# Altium project ESP32-S3.PrjPcb
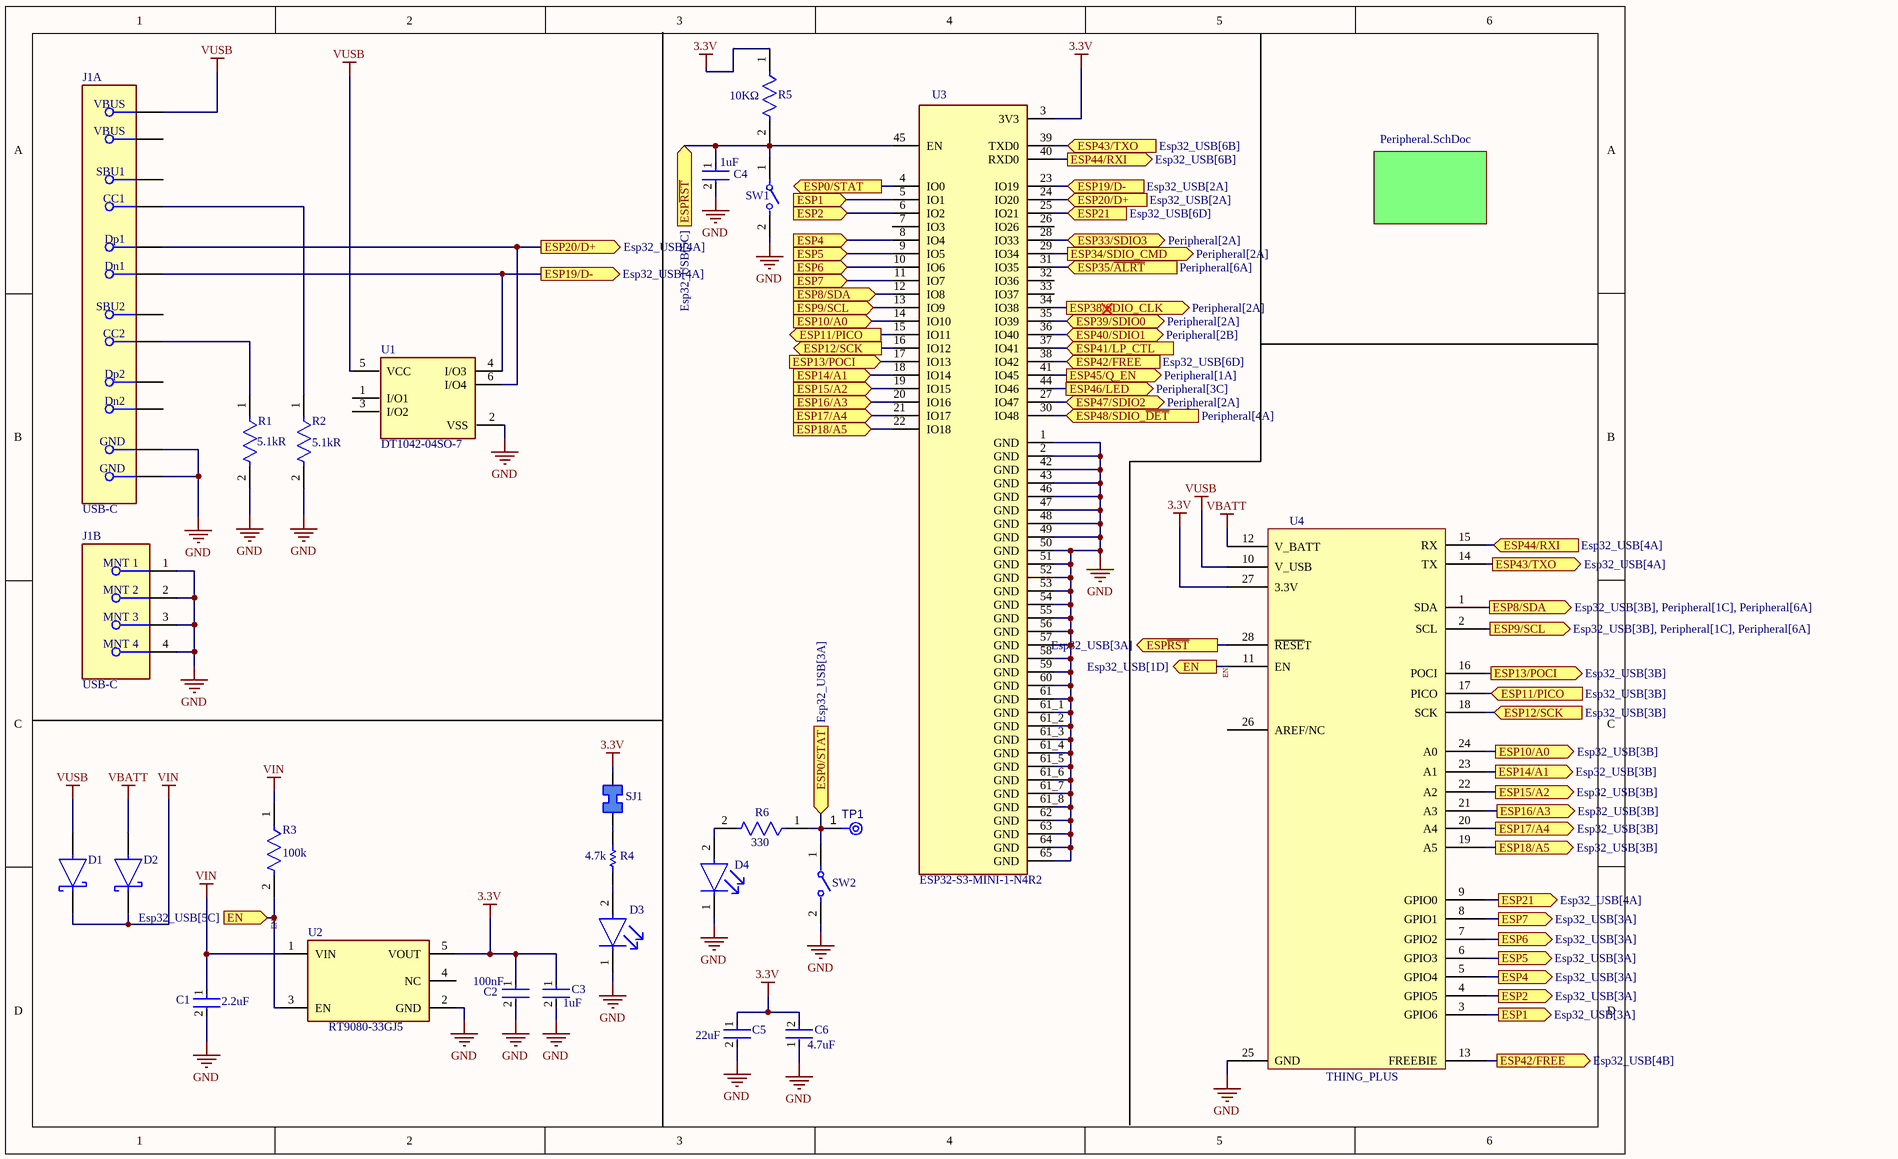
[diagram p0: Esp32_USB.SchDoc]
2 sheets, 56 parts. Net scope: flat (ports and power ports of the same name join across sheets).
Board file: PCB.PcbDoc
Sheets:
  Esp32_USB.SchDoc
    Designator = Peripheral.SchDoc

## Sheet Esp32_USB.SchDoc
size 304 x 215 mm; SheetNumber: 1; SheetTotal: 2

### Parts
C1  Capacitance: 2.2uF  [FP-GRM155-0_1-IPC_C]  (hidden comment: GRM155C81A225KE44D)
C2  Capacitance: 100nF  [FP-GRM033-0_03-IPC_B]  (hidden comment: GRM033C70J104KE14D)
C3  Capacitance: 1uF  [FP-GRM155-0_05-IPC_C]  (hidden comment: GRM155R61C105KA12D)
C4  Capacitance: 1uF  [FP-0402-L_1_0_0_05-W_0_5-IPC_B]  (hidden comment: EMK105BJ105KVHF)
C5  Capacitance: 22uF  [FP-0603-L_1_6_0_2-W_0_8_0-IPC_B]  (hidden comment: JMK107BC6226MA-T)
C6  Capacitance: 4.7uF  [FP-0402-L_1_0_0_15-W_0_5-IPC_C]  (hidden comment: JMK105BC6475MV-F)
D1  BAT60AE6327HTSA1  [FP-PG-SOD323-2-IPC_C]  (value not drawn)
D2  BAT60AE6327HTSA1  [FP-PG-SOD323-2-IPC_C]  (value not drawn)
D3  LTST-C191KRKT  [FP-LTST-C191KRKT-MFG]  (value not drawn)
D4  LTST-C194TGKT  [FP-LTST-C194TGKT-MFG]  (value not drawn)
J1  USB-C  [FP-2171790001-MFG]  (parts A,B of 2)
R1  Resistance: 5.1kR  [FP-AC0402-IPC_C]  (hidden comment: AC0402JR-075K1L)
R2  Resistance: 5.1kR  [FP-AC0402-IPC_C]  (hidden comment: AC0402JR-075K1L)
R3  Resistance: 100k  [FP-CRCW0402-C-e3-MFG]  (hidden comment: CRCW0402100KFKEDC)
R4  Resistance: 4.7k  [RESC1005X40X25LL05T10]  (hidden comment: CRCW04024K70FKEDHP)
R5  value 10KΩ  [FP-RT0201-MFG]  (hidden comment: RT0201FRE0710KL)
R6  Resistance: 330  [FP-AC0603-MFG]  (hidden comment: AC0603FR-07330RL)
SJ1  Solder Jumper  [Solder Jumper-Footprint-1]  (value not drawn)
SW1  FSM2JART  [FP-FSM2JART-MFG]  (value not drawn)
SW2  FSM2JART  [FP-FSM2JART-MFG]  (value not drawn)
TP1  TPAD6R  [TP06R]  (value not drawn)  (no BOM)
U1  DT1042-04SO-7  [FP-SOT26_SC74R-MFG]
U2  RT9080-33GJ5  [FP-RT9080-33GJ5-IPC_C]
U3  ESP32-S3-MINI-1-N4R2  [XCVR_ESP32-S3-MINI-1-N4R2]
U4  THING_PLUS  (no BOM)

### Sub-sheets
Designator = Peripheral.SchDoc: no entries

### Ports
EN (in, see Esp32_USB[5C]), EN (out, see Esp32_USB[1D]), ESP0/STAT (in, see Esp32_USB[3A]), ESP0/STAT (out, see Esp32_USB[4C]), ESP1 (in, see Esp32_USB[6D]), ESP1 (out, see Esp32_USB[3A]), ESP2 (in, see Esp32_USB[6D]), ESP2 (out, see Esp32_USB[3A]), ESP4 (in, see Esp32_USB[6D]), ESP4 (out, see Esp32_USB[3A]), ESP5 (in, see Esp32_USB[6D]), ESP5 (out, see Esp32_USB[3A]), ESP6 (in, see Esp32_USB[6D]), ESP6 (out, see Esp32_USB[3A]), ESP7 (in, see Esp32_USB[6D]), ESP7 (out, see Esp32_USB[3A]), ESP8/SDA (in, see Esp32_USB[6C], Peripheral[1C], Peripheral[6A]), ESP8/SDA (out, see Esp32_USB[3B], Peripheral[1C], Peripheral[6A]), ESP9/SCL (in, see Esp32_USB[6C], Peripheral[1C], Peripheral[6A]), ESP9/SCL (out, see Esp32_USB[3B], Peripheral[1C], Peripheral[6A]), ESP10/A0 (in, see Esp32_USB[6C]), ESP10/A0 (out, see Esp32_USB[3B]), ESP11/PICO (in, see Esp32_USB[3B]), ESP11/PICO (out, see Esp32_USB[6C]), ESP12/SCK (in, see Esp32_USB[3B]), ESP12/SCK (out, see Esp32_USB[6C]), ESP13/POCI (in, see Esp32_USB[6C]), ESP13/POCI (out, see Esp32_USB[3B]), ESP14/A1 (in, see Esp32_USB[6C]), ESP14/A1 (out, see Esp32_USB[3B]), ESP15/A2 (in, see Esp32_USB[6C]), ESP15/A2 (out, see Esp32_USB[3B]), ESP16/A3 (in, see Esp32_USB[6C]), ESP16/A3 (out, see Esp32_USB[3B]), ESP17/A4 (in, see Esp32_USB[6C]), ESP17/A4 (out, see Esp32_USB[3B]), ESP18/A5 (in, see Esp32_USB[6C]), ESP18/A5 (out, see Esp32_USB[3B]), ESP19/D- (in, see Esp32_USB[2A]), ESP19/D- (out, see Esp32_USB[4A]), ESP20/D+ (in, see Esp32_USB[2A]), ESP20/D+ (out, see Esp32_USB[4A]), ESP21 (in, see Esp32_USB[6D]), ESP21 (out, see Esp32_USB[4A]), ESP33/SDIO3 (bidir, see Peripheral[2A]), ESP34/SDIO_CMD (out, see Peripheral[2A]), ESP35/~{ALRT} (in, see Peripheral[6A]), ESP38/SDIO_CLK (out, see Peripheral[2A]), ESP39/SDIO0 (bidir, see Peripheral[2A]), ESP40/SDIO1 (bidir, see Peripheral[2B]), ESP41/LP_CTL (in), ESP42/FREE (in, see Esp32_USB[6D]), ESP42/FREE (out, see Esp32_USB[4B]), ESP43/TXO (in, see Esp32_USB[6B]), ESP43/TXO (out, see Esp32_USB[4A]), ESP44/RXI (in, see Esp32_USB[4A]), ESP44/RXI (out, see Esp32_USB[6B]), ESP45/Q_EN (out, see Peripheral[1A]), ESP46/LED (out, see Peripheral[3C]), ESP47/SDIO2 (bidir, see Peripheral[2A]), ESP48/SDIO_~{DET} (in, see Peripheral[4A]), ESP~{RST} (in, see Esp32_USB[5C]), ESP~{RST} (out, see Esp32_USB[3A])

### Nets
3.3V: C2.1 C3.1 C5.1 C6.2 R5.1 SJ1.1 U2.5(VOUT) U3.3(3V3) U4.27(3.3V)
GND: C1.2 C2.2 C3.2 C4.2 C5.2 C6.1 D3.1(C) D4.1(C) J1.1(MNT_1) J1.2(MNT_2) J1.3(MNT_3) J1.4(MNT_4) J1.A1-B12(GND) J1.B1-A12(GND) R1.2 R2.2 SW1.2 SW2.2 U1.2(VSS) U2.2(GND) U3.1(GND) U3.2(GND) U3.42(GND) U3.43(GND) U3.46(GND) U3.47(GND) U3.48(GND) U3.49(GND) U3.50(GND) U3.51(GND) U3.52(GND) U3.53(GND) U3.54(GND) U3.55(GND) U3.56(GND) U3.57(GND) U3.58(GND) U3.59(GND) U3.60(GND) U3.61(GND) U3.61_1(GND) U3.61_2(GND) U3.61_3(GND) U3.61_4(GND) U3.61_5(GND) U3.61_6(GND) U3.61_7(GND) U3.61_8(GND) U3.62(GND) U3.63(GND) U3.64(GND) U3.65(GND) U4.25(GND)
VBATT: D2.2(A) U4.12(V_BATT)
VIN: C1.1 D1.1(C) D2.1(C) R3.1 U2.1(VIN)
VUSB: D1.2(A) J1.A4-B9(VBUS) U1.5(VCC) U4.10(V_USB)
EN: R3.2 U2.3(EN) U4.11(EN) ; port EN
NetC4_1: C4.1 R5.2 SW1.1 U3.45(EN) U4.28(~{RESE}T) ; port ESP~{RST}
NetD3_2: D3.2(A) R4.2
NetD4_2: D4.2(A) R6.2
NetJ1_A5: J1.A5(CC1) R2.1
NetJ1_A6: J1.A6(Dp1) U1.6(I/O4) U3.24(IO20) ; port ESP20/D+
NetJ1_A7: J1.A7(Dn1) U1.4(I/O3) U3.23(IO19) ; port ESP19/D-
NetJ1_B5: J1.B5(CC2) R1.1
NetP1_1: U3.12(IO8) U4.1(SDA) ; port ESP8/SDA
NetP1_2: U3.13(IO9) U4.2(SCL) ; port ESP9/SCL
NetR4_1: R4.1 SJ1.2
NetR6_1: R6.1 SW2.1 TP1.1(TP) U3.4(IO0) ; port ESP0/STAT
NetR7_1: U3.41(IO45) ; port ESP45/Q_EN
NetR9_2: U3.27(IO47) ; port ESP47/SDIO2
NetR10_2: U3.28(IO33) ; port ESP33/SDIO3
NetR11_2: U3.29(IO34) ; port ESP34/SDIO_CMD
NetR12_2: U3.34(IO38) ; port ESP38/SDIO_CLK
NetSD1_7: U3.35(IO39) ; port ESP39/SDIO0
NetSD1_8: U3.36(IO40) ; port ESP40/SDIO1
NetSD1_9: U3.30(IO48) ; port ESP48/SDIO_~{DET}
NetU3_5: U3.5(IO1) U4.3(GPIO6) ; port ESP1
NetU3_6: U3.6(IO2) U4.4(GPIO5) ; port ESP2
NetU3_8: U3.8(IO4) U4.5(GPIO4) ; port ESP4
NetU3_9: U3.9(IO5) U4.6(GPIO3) ; port ESP5
NetU3_10: U3.10(IO6) U4.7(GPIO2) ; port ESP6
NetU3_11: U3.11(IO7) U4.8(GPIO1) ; port ESP7
NetU3_14: U3.14(IO10) U4.24(A0) ; port ESP10/A0
NetU3_15: U3.15(IO11) U4.17(PICO) ; port ESP11/PICO
NetU3_16: U3.16(IO12) U4.18(SCK) ; port ESP12/SCK
NetU3_17: U3.17(IO13) U4.16(POCI) ; port ESP13/POCI
NetU3_18: U3.18(IO14) U4.23(A1) ; port ESP14/A1
NetU3_19: U3.19(IO15) U4.22(A2) ; port ESP15/A2
NetU3_20: U3.20(IO16) U4.21(A3) ; port ESP16/A3
NetU3_21: U3.21(IO17) U4.20(A4) ; port ESP17/A4
NetU3_22: U3.22(IO18) U4.19(A5) ; port ESP18/A5
NetU3_25: U3.25(IO21) U4.9(GPIO0) ; port ESP21
NetU3_31: U3.31(IO35) ; port ESP35/~{ALRT}
NetU3_37: U3.37(IO41) ; port ESP41/LP_CTL
NetU3_38: U3.38(IO42) U4.13(FREEBIE) ; port ESP42/FREE
NetU3_39: U3.39(TXD0) U4.14(TX) ; port ESP43/TXO
NetU3_40: U3.40(RXD0) U4.15(RX) ; port ESP44/RXI
NetU3_44: U3.44(IO46) ; port ESP46/LED

Not connected (* = marked no-connect by the designer): J1 A8(SBU1) B4-A9(VBUS) B6(Dp2) B7(Dn2) B8(SBU2); U1 1(I/O1) 3(I/O2); U2 4(NC); U3 7(IO3) 26(IO26) 32(IO36) 33(IO37); U4 26(AREF/NC)

### Library data of the parts
C1 = CMP-06035-004415-1: Chip Multilayer Ceramic Capacitors for General Purpose, 0402, 2.2uF, X6S, 22%, 10%, 10V; Max Operating Temperature: 105°C; Case Code (Imperial): 0402; Mount: Surface Mount; Case/Package: 0402; Termination: SMD/SMT; Voltage Rating: 10V; Tolerance: 10%; Thickness: 0.022inch; Length: 0.039inch; Packaging: Tape and Reel; Weight: 0.000212oz; Width: 0.02inch; Dielectric: X6S; Package Quantity: 10000; Min Operating Temperature: -55°C; Height: 0.5mm; Case Code (Metric): 1005; Voltage Rating (DC): 10V
C2 = CMP-06035-000516-1: Chip Multilayer Ceramic Capacitors for General Purpose, 0201, 0.10uF, X7S, 22%, 10%, 6.3V; Dielectric: X7S; Thickness: 300um; Length: 600um; Voltage Rating (DC): 6.3V; Width: 300um; Tolerance: 10%
C3 = CMP-2008-04573-2: Chip Multilayer Ceramic Capacitors for General Purpose, 0402, 1.0uF, X5R, 15%, 10%, 16V; Case Code (Imperial): 0402; Max Operating Temperature: 85°C; Mount: Surface Mount; Voltage Rating (DC): 16V; Material: Ceramic; Depth: 0.5mm; Voltage: 16V; Height: 0.5mm; Dielectric: X5R; Thickness: 0.022inch; Lead Free: Lead Free; Min Operating Temperature: -55°C; Packaging: Tape and Reel; Radiation Hardening: No; Case/Package: 0402; Width: 0.02inch; Length: 1mm; REACH SVHC: No SVHC; Case Code (Metric): 1005; Voltage Rating: 16V; Tolerance: 10%
C4 = CMP-14477-000084-2: None; Dielectric: X5R; Tolerance: 10%; Voltage Rating: 16V; Height: 0.5mm; Lead Free: Lead Free; Halogen Free: Halogen Free; Min Operating Temperature: -55°C; Ratings: AEC-Q200; Case/Package: 0402; Weight: 2.3E-05oz; Length: 0.039inch; Voltage Rating (DC): 16V; Packaging: Tape and Reel; Thickness: 0.022inch; Width: 0.5mm; Mount: Surface Mount; RoHS Compliant: Yes; Package Quantity: 10000; Case Code (Metric): 1005; Max Operating Temperature: 85°C; Case Code (Imperial): 0402; Termination: SMD/SMT
C5 = CMP-14477-000021-3: Multilayer Ceramic Capacitor 22uF 6.3V X6S 20% SMD 0603 T/R; Case Code (Imperial): 0603; Packaging: Tape and Reel; Max Operating Temperature: 105°C; Case Code (Metric): 1608; Case/Package: 0603; Min Operating Temperature: -55°C; Mount: Surface Mount; Voltage Rating: 6.3V; Tolerance: 20%; RoHS Compliant: Yes
C6 = CMP-14477-001053-2: None; Voltage Rating: 6.3V; Tolerance: 20%; Case/Package: 0402; Packaging: Tape and Reel; Min Operating Temperature: -55°C; Max Operating Temperature: 105°C; Case Code (Metric): 1005; RoHS Compliant: Yes; Lead Free: Lead Free; Mount: Surface Mount; Case Code (Imperial): 0402
D1 D2 = CMP-32890-000004-1: DIODE SCHOTTKY 10V 3A SOD323-2; Forward Voltage: 370mV; Polarity: Standard; Peak Non-Repetitive Surge Current: 5A; Element Configuration: Single; Max Operating Temperature: 85°C; Current Rating: 3A; Number of Pins: 2; Mount: Surface Mount; Forward Current: 3A; Max Reverse Voltage (DC): 10V; Output Current: 3A; Contact Plating: Tin; Average Rectified Current: 3A; Lead Free: Lead Free; Max Repetitive Reverse Voltage (Vrrm): 10V; Voltage Rating (DC): 10V; Radiation Hardening: No; Halogen Free: Not Halogen Free; Case/Package: SOD-323-2; REACH SVHC: No SVHC; Min Operating Temperature: -55°C; Packaging: Tape and Reel
D3 = CMP-2000-05199-2: NexarPartId: 549908; Illumination Color: Red; Lens Transparency: Clear; Luminous Intensity: 54mcd; Current: 2A; Forward Current: 20mA; Number of Elements: 1; Power Rating: 75mW; Lens Color: Colorless; Wavelength: 639nm; Viewing Angle: 130°; Voltage: 2V; Dominant Wavelength: 631nm; Reverse Voltage: 5V; Height: 550µm; Length: 1.6mm; Number of Pins: 2; Packaging: Tape and Reel; Mount: Surface Mount; Case Code (Metric): 1608; Radiation Hardening: No; Case Code (Imperial): 0603; Test Current: 20mA; Number of LEDs: 1; Schedule B: 8541402000, 8541402000; Lead Free: Lead Free; Power Dissipation: 75mW; RoHS: Compliant; Forward Voltage: 2V; Lens Style: Clear; Color: Red; Max Operating Temperature: 85°C; Depth: 800µm; Width: 800µm; Min Operating Temperature: -55°C; Case/Package: 0603
D4 = CMP-22017-000031-1: LED GREEN CLEAR SMD; Forward Current: 5mA; Forward Voltage: 3.2V; Luminous Intensity: 260.5mcd; Dominant Wavelength: 525nm; Lens Color: Colorless; Test Current: 20mA; Viewing Angle: 130°; Lens Style: Diffused; Number of LEDs: 1; Case/Package: 0603; Case Code (Imperial): 0603; Color: Green; Height: 0.35mm; Number of Pins: 2; Packaging: Tape and Reel; Mount: Surface Mount; Illumination Color: Green; Max Operating Temperature: 80°C; Case Code (Metric): 1608; Length: 1.6mm; Width: 0.8mm; Lead Free: Lead Free; Min Operating Temperature: -20°C; Radiation Hardening: No; Lens Transparency: Clear; Package Quantity: 3000
J1 = CMP-04767-000028-2: CONN RCP USB2.0 TYP C 24P SMD RA; NexarPartId: 117190526; Gender: Receptacle; Number of Contacts: 16; Current Rating: 1.25A; Voltage Rating: 30V; Min Operating Temperature: -40°C; USB Standard: USB 2.0; Height: 3.36mm; Contact Material: Gold, Nickel; Max Operating Temperature: 85°C
R1 R2 = CMP-03412-038544-1: RES 5.1kΩ ±5% 0.063W 0402; Temperature Coefficient: 100ppm/°C; Voltage Rating: 50V; Power Rating: 62.5mW; Max Power Dissipation: 63mW; Tolerance: 5%; Features: Moisture Resistant; Packaging: Tape and Reel; Case Code (Imperial): 0402; Min Operating Temperature: -55°C; Series: AC; Length: 0.039inch; Number of Terminations: 2; Weight: 2.3E-05oz; Width: 0.5mm; Case/Package: 0402; RoHS Compliant: Yes; Max Operating Temperature: 155°C; Termination: SMD/SMT; Case Code (Metric): 1005; Height: 0.015inch; Resistor Type: Thick Film
R3 = CMP-02407-010951-1: RES 100K OHM 1% 1/16W 0402; Temperature Coefficient: 100ppm/°C; Power Rating: 62.5mW; Lead Free: Lead Free; Length: 1mm; Tolerance: 1%; Resistor Type: Thick Film; Contact Plating: Tin; Case/Package: SMD/SMT; Min Operating Temperature: -55°C; RoHS Compliant: Yes; Termination: Wraparound; Max Operating Temperature: 155°C; Mount: Surface Mount
R4 = CMP-2002-03050-1: Manufacturer: Vishay Dale; Part Number: CRCW04024K70FKEDHP
R5 = CMP-03412-013100-1: RES SMD 10K OHM 1% 1/20W 0201; Manufacturer: Yageo; Temperature Coefficient: 50 ppm/°C; Voltage Rating: 25V; Power Rating: 0.05W; Tolerance: 0.01; Digikey Description: RES SMD 10K OHM 1% 1/20W 0201; Resistance: 10KΩ; ComponentLink2Description: Datasheet; Series: RT; Composition: Thin Film; Ipc Land Pattern Name: RESC6030X23; Device Class L3: Chip SMD Resistors; Device Class L1: Passive Components; RoHS: TRUE; Category: Res; Manufacturer Part Number: RT0201FRE0710KL; ComponentLink2URL: http://www.yageo.com/documents/recent/PYu-RT_1-to-0.01_RoHS_L_9.pdf; Automotive: No; Temperature: -55°C to +125°C; Temperature Range Low: -55°C; Height: 0.26mm; Package: RT0201; Device Class L2: Resistors; Temperature Range High: +125°C; Octopart: https://octopart.com/rt0201fre0710kl-yageo-71392129; Footprint Url: http://www.yageo.com/exep/pages/download/literatures/PYu-R_Mount_10.pdf; Mouser Description: Res Thin Film 0201 10K Ohm 1% 1/20W ±50ppm/°C Molded SMD Paper T/R; Lead Free: Yes
R6 = CMP-03412-003137-2: RES 330Ω 1.00% 0.1W 0603; Voltage Rating: 50V; Temperature Coefficient: 100ppm/°C; Tolerance: 1%; Max Power Dissipation: 100mW; RoHS Compliant: Yes; Construction: Rectangular; Series: AC; Case Code (Metric): 1608; Termination: SMD/SMT; Military Standard: Not; Ratings: AEC-Q200; Case/Package: 0603; Case Code (Imperial): 0603; Length: 1.6mm; Packaging: Tape and Reel; Number of Terminations: 2; Height: 0.45mm; Resistor Type: Thick Film; Depth: 0.8mm; Min Operating Temperature: -55°C; Features: Moisture Resistant; Power Rating: 100mW; Max Operating Temperature: 155°C; Width: 0.8mm
SJ1 = CMP-00030-00001-3: 2 pad Solder Jumper; Max Operating Temperature: 155°C; Pins: 2; Min Operating Temperature: -55°C; Case/Package: 1206; Mounting Technology: Surface Mount
SW1 SW2 = CMP-03407-000009-1: SWITCH TACTILE SPST-NO 0.05A 12V; Actuator Length: 0.7mm; Switch Function: Off-Mom; Throw Configuration: SPST; Electrical Life: 100000Cycles; Illumination Type: Non-Illuminated; Contact Resistance: 100mR; Operating Force: 260gf; Actuator Type: Standard; Actuator Material: Resin; Contact Current Rating: 50mA; Type: Switch; Contact Plating: Silver; ELV: Compliant; Lead Free: Lead Free; Max Voltage Rating (DC): 12V; Min Operating Temperature: -35°C; Mount: Through Hole; Series: FSMJRT; Max Operating Temperature: 105°C; RoHS Compliant: Yes; Termination: Solder; REACH SVHC: No SVHC; Contact Material: Copper Alloy; Orientation: Straight; Current Rating: 50mA; Package Quantity: 1000; Voltage Rating (DC): 12V; Packaging: Tape and Reel
TP1 = CMP-00028-00002-2: 0.6mm round; Pins: 1
U1 = CMP-12828-000009-1: TVS DIODE 5V 9V SOT26; Manufacturer: Diodes Inc.; Peak Pulse Power: 55W; Value: 0.65pF; Peak Pulse Current: 6A; Clamping Voltage: 6.3V; Number Of Channels: 4; Standoff Height: 0.013mm; Direction: Unidirectional; Breakdown Voltage: 6.2V; Device Class L2: TVS Diodes; Octopart: https://octopart.com/dt1042-04so-7-diodes+inc.-30954914; Reverse Standoff Voltage: 5V; RoHS: TRUE; ComponentLink2Description: Datasheet; Digikey Description: TVS DIODE 5V 9V SOT26; Temperature: -55°C to +85°C; Package: SOT26 (SC74R); Device Class L3: unset; Height: 1.4mm; Device Class L1: Circuit Protection; Automotive: No; Category: Diode; Temperature Range Low: -55°C; Lead Free: Yes; ComponentLink2URL: https://www.diodes.com/assets/Datasheets/DT1042-04SO.pdf; Footprint Url: https://www.diodes.com/assets/Package-Files/SOT26-SC74R.pdf; Capacitance: 0.65pF; Mouser Description: DT1042-04SO Series 6.2 V 6 A 4 Channel Low Capacitance TVS Diode Array - SOT-26; Temperature Range High: +85°C; Manufacturer Part Number: DT1042-04SO-7; Ipc Land Pattern Name: SOT95P280X140-6
U2 = CMP-79890-000003-1: IC REG LIN 3.3V 600MA TSOT23-5; Power Supply Rejection Ratio (PSRR): 75dB; Output Type: Fixed; Max Input Voltage: 5.5V; Dropout Voltage: 530mV; Output Configuration: Positive; Quiescent Current: 4uA; Number of Regulators: 1; Packaging: Cut Tape; RoHS Compliant: Yes; Mount: Surface Mount; Max Operating Temperature: 85°C; Min Output Voltage: 3.3V; Output Current: 600mA; Min Operating Temperature: -40°C; Case/Package: SOT-23-5
U3 = ESP32-S3-MINI-1-N4R2: Bluetooth, WiFi 802.11b/g/n, Bluetooth v5.0 Transceiver Module 2.4GHz PCB Trace Surface Mount; MF: Espressif Systems; SnapEDA_Link: https://www.snapeda.com/parts/ESP32-S3-MINI-1-N4R2/Espressif+Systems/view-part/?ref=snap; Package: None; Value: *; MP: ESP32-S3-MINI-1-N4R2; Check_prices: https://www.snapeda.com/parts/ESP32-S3-MINI-1-N4R2/Espressif+Systems/view-part/?ref=eda; Supplier 1: DigiKey; Supplier Part Number 1: 1965-ESP32-S3-MINI-1-N4R2CT-ND
U4 = THING_PLUS: Supplier 1: DigiKey; Supplier Part Number 1: 1568-14713-ND

## Sheet Peripheral.SchDoc
size 381 x 215 mm; SheetNumber: 2; SheetTotal: 2
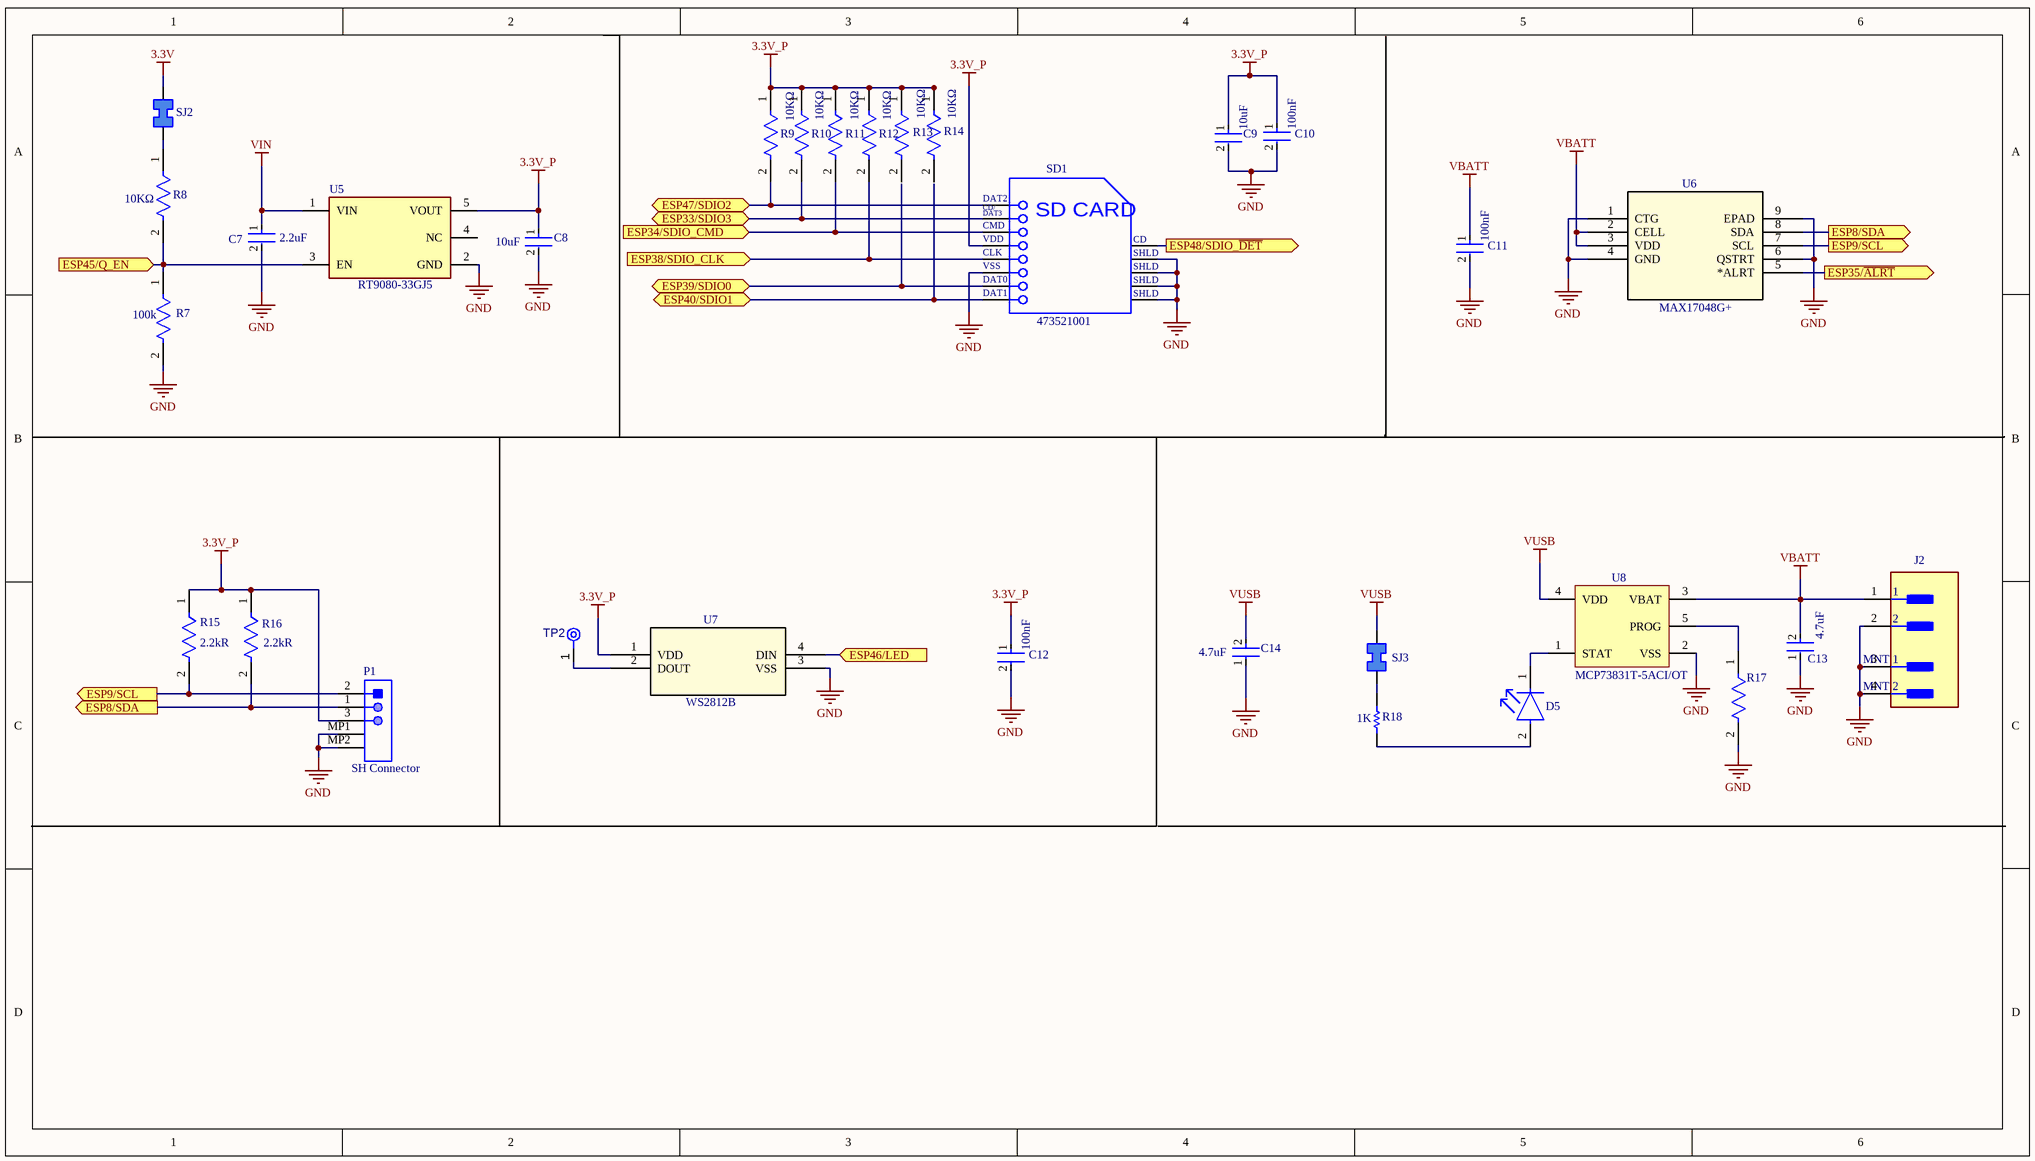
[diagram p1: Peripheral.SchDoc]

### Parts
C7  Capacitance: 2.2uF  [FP-GRM155-0_1-IPC_C]  (hidden comment: GRM155C81A225KE44D)
C8  Capacitance: 10uF  [FP-CL21-IPC_C]  (hidden comment: CL21A106MQFNNNE)
C9  Capacitance: 10uF  [FP-CL21-IPC_C]  (hidden comment: CL21A106MQFNNNE)
C10  Capacitance: 100nF  [FP-GRM033-0_03-IPC_B]  (hidden comment: GRM033C70J104KE14D)
C11  Capacitance: 100nF  [FP-GRM033-0_03-IPC_B]  (hidden comment: GRM033C70J104KE14D)
C12  Capacitance: 100nF  [FP-GRM033-0_03-IPC_B]  (hidden comment: GRM033C70J104KE14D)
C13  Capacitance: 4.7uF  [FP-0402-L_1_0_0_15-W_0_5-IPC_C]  (hidden comment: JMK105BC6475MV-F)
C14  Capacitance: 4.7uF  [FP-GRM219-0_15-0_1-IPC_C]  (hidden comment: GRM219R6YA475MA73D)
D5  LTST-C191KSKT  [FP-LTST-C191KSKT-MFG]  (value not drawn)
J2  SM02B-SRSS-TB (LF)(SN)  [FP-SM02B-SRSS-TB_LF_SN-MFG]  (value not drawn)
P1  SH Connector  [JST-SM03B-SRSS-TB_V]
R7  Resistance: 100k  [FP-CRCW0402-C-e3-MFG]  (hidden comment: CRCW0402100KFKEDC)
R8  value 10KΩ  [FP-RT0201-MFG]  (hidden comment: RT0201FRE0710KL)
R9  value 10KΩ  [FP-RT0201-MFG]  (hidden comment: RT0201FRE0710KL)
R10  value 10KΩ  [FP-RT0201-MFG]  (hidden comment: RT0201FRE0710KL)
R11  value 10KΩ  [FP-RT0201-MFG]  (hidden comment: RT0201FRE0710KL)
R12  value 10KΩ  [FP-RT0201-MFG]  (hidden comment: RT0201FRE0710KL)
R13  value 10KΩ  [FP-RT0201-MFG]  (hidden comment: RT0201FRE0710KL)
R14  value 10KΩ  [FP-RT0201-MFG]  (hidden comment: RT0201FRE0710KL)
R15  Resistance: 2.2kR  [FP-CRCW0402-e3-IPC_B]  (hidden comment: CRCW04022K20FKEDC)
R16  Resistance: 2.2kR  [FP-CRCW0402-e3-IPC_B]  (hidden comment: CRCW04022K20FKEDC)
R17  CR0402AFX-2001GLF  [FP-CR0402A-IPC_A]  (value not drawn)
R18  Resistance: 1K  [RESC1005X40X25ML10T10]  (hidden comment: 1-1622826-8)
SD1  473521001  [MOLX-473521001_V]
SJ2  Solder Jumper  [Solder Jumper-Footprint-1]  (value not drawn)
SJ3  Solder Jumper  [Solder Jumper-Footprint-1]  (value not drawn)
TP2  TPAD6R  [TP06R]  (value not drawn)  (no BOM)
U5  RT9080-33GJ5  [FP-RT9080-33GJ5-IPC_C]
U6  MAX17048G+  [21-0168_T822+3_MXM]
U7  WS2812B  [WS2812B_WDS]
U8  MCP73831T-5ACI/OT  [SOT-23-OT5_N]

### Ports
ESP8/SDA (out, see Esp32_USB[3B], Esp32_USB[6C], Peripheral[1C]), ESP8/SDA (out, see Esp32_USB[3B], Esp32_USB[6C], Peripheral[6A]), ESP9/SCL (out, see Esp32_USB[3B], Esp32_USB[6C], Peripheral[1C]), ESP9/SCL (out, see Esp32_USB[3B], Esp32_USB[6C], Peripheral[6A]), ESP33/SDIO3 (bidir, see Esp32_USB[4A]), ESP34/SDIO_CMD (in, see Esp32_USB[4A]), ESP35/~{ALRT} (out, see Esp32_USB[4A]), ESP38/SDIO_CLK (in, see Esp32_USB[4B]), ESP39/SDIO0 (bidir, see Esp32_USB[4B]), ESP40/SDIO1 (bidir, see Esp32_USB[4B]), ESP45/Q_EN (in, see Esp32_USB[4B]), ESP46/LED (in, see Esp32_USB[4B]), ESP47/SDIO2 (bidir, see Esp32_USB[4B]), ESP48/SDIO_~{DET} (out, see Esp32_USB[4B])

### Nets
3.3V: SJ2.1
3.3V_P: C8.1 C9.1 C10.1 C12.1 P1.3 R9.1 R10.1 R11.1 R12.1 R13.1 R14.1 R15.1 R16.1 SD1.4(VDD) U5.5(VOUT) U7.1(VDD)
GND: C7.2 C8.2 C9.2 C10.2 C11.2 C12.2 C13.1 C14.1 J2.2 J2.3(MNT_1) J2.4(MNT_2) P1.MP1 P1.MP2 R7.2 R17.2 SD1.6(VSS) SD1.10(SHLD) SD1.11(SHLD) SD1.12(SHLD) SD1.13(SHLD) U5.2(GND) U6.1(CTG) U6.4(GND) U6.6(QSTRT) U6.9(EPAD) U7.3(VSS) U8.2(VSS)
VBATT: C11.1 C13.2 J2.1 U6.2(CELL) U6.3(VDD) U8.3(VBAT)
VIN: C7.1 U5.1(VIN)
VUSB: C14.2 SJ3.1 U8.4(VDD)
NetD5_1: D5.1(C) U8.1(STAT)
NetD5_2: D5.2(A) R18.2
NetP1_1: P1.1 R16.2 U6.8(SDA) ; port ESP8/SDA
NetP1_2: P1.2 R15.2 U6.7(SCL) ; port ESP9/SCL
NetR7_1: R7.1 R8.2 U5.3(EN) ; port ESP45/Q_EN
NetR8_1: R8.1 SJ2.2
NetR9_2: R9.2 SD1.1(DAT2) ; port ESP47/SDIO2
NetR10_2: R10.2 SD1.2(CD/DAT3) ; port ESP33/SDIO3
NetR11_2: R11.2 SD1.3(CMD) ; port ESP34/SDIO_CMD
NetR12_2: R12.2 SD1.5(CLK) ; port ESP38/SDIO_CLK
NetR17_1: R17.1 U8.5(PROG)
NetR18_1: R18.1 SJ3.2
NetSD1_7: SD1.7(DAT0) ; port ESP39/SDIO0
NetSD1_8: SD1.8(DAT1) ; port ESP40/SDIO1
NetSD1_9: SD1.9(CD) ; port ESP48/SDIO_~{DET}
NetTP2_1: TP2.1(TP) U7.2(DOUT)
NetU3_31: U6.5(*ALRT) ; port ESP35/~{ALRT}
NetU3_44: U7.4(DIN) ; port ESP46/LED

Not connected (* = marked no-connect by the designer): R13 2; R14 2; U5 4(NC)

### Notes on the sheet
- (in symbol CMP-2000-05848-1) CD/; DAT3; SD CARD

### Library data of the parts
C7 = CMP-06035-004415-1: as C1 on sheet Esp32_USB; Max Operating Temperature: 105°C; Case Code (Imperial): 0402; Mount: Surface Mount; Case/Package: 0402; Termination: SMD/SMT; Voltage Rating: 10V; Tolerance: 10%; Thickness: 0.022inch; Length: 0.039inch; Packaging: Tape and Reel; Weight: 0.000212oz; Width: 0.02inch; Dielectric: X6S; Package Quantity: 10000; Min Operating Temperature: -55°C; Height: 0.5mm; Case Code (Metric): 1005; Voltage Rating (DC): 10V
C8 C9 = CMP-13271-000780-1: CL21 Series 0805 10uF 6.3V ±20% Tolerance X5R Multilayer Ceramic Chip Capacitor; Thickness: 0.053inch; Voltage Rating: 6.3V; Case Code (Metric): 2012; Width: 0.049inch; Radiation Hardening: No; Height: 1.25mm; Voltage Rating (DC): 6.3V; Depth: 1.25mm; Tolerance: 20%; Lead Free: Lead Free; Case Code (Imperial): 0805; Max Operating Temperature: 85°C; Length: 2mm; Packaging: Tape and Reel; Mount: Surface Mount; Dielectric: X5R; Case/Package: 0805; Min Operating Temperature: -55°C
C10-C12 = CMP-06035-000516-1: as C2 on sheet Esp32_USB; Dielectric: X7S; Thickness: 300um; Length: 600um; Voltage Rating (DC): 6.3V; Width: 300um; Tolerance: 10%
C13 = CMP-14477-001053-2: as C6 on sheet Esp32_USB; Case/Package: 0402; Packaging: Tape and Reel; Min Operating Temperature: -55°C; Max Operating Temperature: 105°C; Case Code (Metric): 1005; RoHS Compliant: Yes; Lead Free: Lead Free; Mount: Surface Mount; Case Code (Imperial): 0402
C14 = CMP-2007-00095-2: Chip Multilayer Ceramic Capacitors for General Purpose, 0805, 4.7uF, X5R, 15%, 20%, 35V; Case Code (Metric): 2012; Case Code (Imperial): 0805; Voltage Rating (DC): 35V; Case/Package: 0805; Voltage Rating: 35V; Depth: 1.25mm; Thickness: 0.037inch; Height: 0.85mm; Lead Free: Lead Free; Package Quantity: 4000; Length: 2mm; Width: 1.25mm; Mount: Surface Mount; Voltage: 35V; Packaging: Tape and Reel; Min Operating Temperature: -55°C; Termination: SMD/SMT; Tolerance: 20%; Dielectric: X5R; REACH SVHC: No SVHC; Max Operating Temperature: 85°C
D5 = CMP-22017-000025-1: LED YELLOW CLEAR SMD; Dominant Wavelength: 597nm; Power Rating: 75mW; Number of LEDs: 1; Lens Style: Diffused; Forward Current: 30mA; Test Current: 20mA; Forward Voltage: 2.4V; Wavelength: 588nm; Viewing Angle: 130°; Lens Color: Colorless; Reverse Voltage: 5V; Luminous Intensity: 180mcd; Case Code (Imperial): 0603; Width: 0.8mm; Power Dissipation: 75mW; Length: 1.6mm; Illumination Color: Yellow; Number of Pins: 2; Case Code (Metric): 1608; Mount: Surface Mount; Number of Elements: 1; Height: 0.55mm; Lens Transparency: Clear; Depth: 0.8mm; Min Operating Temperature: -55°C; Case/Package: 0603; Radiation Hardening: No; Max Operating Temperature: 85°C; Package Quantity: 1; Packaging: Tape and Reel; Lead Free: Lead Free; Color: Yellow
J2 = CMP-17439-000368-1: CONN HEADER SMD R/A 2POS 1MM; Max Current Rating: 1A; Voltage Rating (AC): 50V; Current Rating: 700mA; Contact Resistance: 40mR; Number of Positions: 2; Insulation Resistance: 100MR; Fastening Type: Pull; Orientation: Right Angle; Insulation Color: Natural; Insulation Material: Nylon; Connector Type: Header; Contact Type: Male Pin; Number of Rows: 1; Housing Material: Polyamide; Contact Material: Copper Alloy; Mount: Surface Mount; Packaging: Tape and Reel; Lead Pitch: 1mm; REACH SVHC: No SVHC; Flammability Rating: UL94 V-0; Termination: Solder; Series: SR; Length: 4mm; Color: Natural; Min Operating Temperature: -25°C; Pitch: 1mm; Depth: 4.95mm; Contact Plating: Tin; Lead Free: Lead Free; Max Operating Temperature: 85°C; Contact Finish - Mating: TIN; Material: Polyamide; Voltage Rating: 50V; Max Voltage Rating (AC): 50V; Housing Color: Beige; Contact Shape: Square; Number of Contacts: 2
P1 = CMP-2000-07077-1: Male Header, Pitch 1 mm, 1 x 3 Position, Height 2.9 mm, -25 to 85 degC, RoHS, Tape and Reel; Manufacturer: JST; Pitch: 1mm; Style/Orientation: RightAngleHeader/Plug; No of Positions: 3; Package Description: Male Header, Pitch 1 mm, 1 x 3 Position, Height 2.9 mm; Manufacturer URL: http://www.jst.com/home2.html; Package Reference: SM03B-SRSS-TB; Type: ShroudedHeader; Termination: Crimp; Mounting Technology: SurfaceMount; Datasheet Version: 11/2010; Datasheet URL: https://datasheet.ciiva.com/26894/getdatasheetpartid-708885-26894671.pdf
R7 = CMP-02407-010951-1: as R3 on sheet Esp32_USB; Lead Free: Lead Free; Length: 1mm; Tolerance: 1%; Resistor Type: Thick Film; Contact Plating: Tin; Case/Package: SMD/SMT; Min Operating Temperature: -55°C; RoHS Compliant: Yes; Termination: Wraparound; Max Operating Temperature: 155°C; Mount: Surface Mount
R8-R14 = CMP-03412-013100-1: as R5 on sheet Esp32_USB; Digikey Description: RES SMD 10K OHM 1% 1/20W 0201; Resistance: 10KΩ; ComponentLink2Description: Datasheet; Series: RT; Composition: Thin Film; Ipc Land Pattern Name: RESC6030X23; Device Class L3: Chip SMD Resistors; Device Class L1: Passive Components; RoHS: TRUE; Category: Res; Manufacturer Part Number: RT0201FRE0710KL; ComponentLink2URL: http://www.yageo.com/documents/recent/PYu-RT_1-to-0.01_RoHS_L_9.pdf; Automotive: No; Temperature: -55°C to +125°C; Temperature Range Low: -55°C; Height: 0.26mm; Package: RT0201; Device Class L2: Resistors; Temperature Range High: +125°C; Octopart: https://octopart.com/rt0201fre0710kl-yageo-71392129; Footprint Url: http://www.yageo.com/exep/pages/download/literatures/PYu-R_Mount_10.pdf; Mouser Description: Res Thin Film 0201 10K Ohm 1% 1/20W ±50ppm/°C Molded SMD Paper T/R; Lead Free: Yes
R15 R16 = CMP-02407-013149-1: RES 2.2K OHM 1% 1/16W 0402; Max Power Dissipation: 63mW; Power Rating: 62.5mW; Temperature Coefficient: 100ppm/°C; RoHS Compliant: Yes; Tolerance: 1%; Case/Package: 0402; Max Operating Temperature: 155°C; Mount: Surface Mount; Case Code (Imperial): 0402; Contact Plating: Tin; Lead Free: Lead Free; Number of Terminations: 2; Min Operating Temperature: -55°C; Case Code (Metric): 1005; Resistor Type: Thick Film; Series: CRCW-C; Packaging: Cut Tape; Termination: Wraparound; Length: 1mm
R17 = CMP-07231-001734-1: AEC-Q200 Compliant Chip Resistors 0402 2kΩ 0.063W 1% 100ppm/°C
R18 = CMP-2002-04643-1: Manufacturer: TE Connectivity / AMP; Part Number: 1-1622826-8
SD1 = CMP-2000-05848-1: MicroSD(TM), Pitch 1.1 mm, 8 Position, Height 1.88 mm, -20 to 85 degC, RoHS, Tape and Reel; Manufacturer: Molex; Datasheet Version: Rev. G, 01/2012; Datasheet URL: http://www.molex.com/pdm_docs/sd/473521001_sd.pdf; Package Reference: 473521001; Manufacturer URL: http://www.molex.com/; Mounting Technology: SurfaceMount; Package Description: MicroSD(TM), Pitch 1.1 mm, 8 Position, Height 1.88 mm; Supplier: Arrow Electronics; Supplier Part Number: 0473521001
SJ2 SJ3 = CMP-00030-00001-3: 2 pad Solder Jumper; Mounting Technology: Surface Mount; Min Operating Temperature: -55°C; Pins: 2; Max Operating Temperature: 155°C; Case/Package: 1206
TP2 = CMP-00028-00002-2: 0.6mm round; Pins: 1
U5 = CMP-79890-000003-1: as U2 on sheet Esp32_USB; Packaging: Cut Tape; RoHS Compliant: Yes; Mount: Surface Mount; Max Operating Temperature: 85°C; Min Output Voltage: 3.3V; Output Current: 600mA; Min Operating Temperature: -40°C; Case/Package: SOT-23-5
U6 = MAX17048G+: 3ÂµA 1-Cell/2-Cell Fuel Gauge with ModelGauge; Manufacturer_Name: Analog Devices Inc; Copyright: Copyright (C) 2025 Ultra Librarian. All rights reserved.; Manufacturer_Part_Number: MAX17048G+; RefDes: RefDes; Type: Type; Supplier 1: DigiKey; Supplier Part Number 1: MAX17048G+T10CT-ND
U7 = WS2812B: No Description Available; Manufacturer_Name: Worldsemi; Copyright: Copyright (C) 2025 Ultra Librarian. All rights reserved.; Manufacturer_Part_Number: WS2812B; RefDes: RefDes; Type: Type; Supplier 1: DigiKey; Supplier Part Number 1: 28085-ND
U8 = CMP-0133-00136-1: Miniature Single-Cell, Fully Integrated Li-Ion, Li-Polymer Charge Management Controller, 4.5V, 5-Pin SOT-23, Industrial Temperature, Tape and Reel; PackageReference: SOT-23-OT5; PackageDescription: 5-Lead Plastic Small Outline Transistor (OT) [SOT-23]; PackageVersion: revBB, Aug-2009; DatasheetVersion: revE, Sep-2008; Code_IPC: SOT23-5

## Nets that join several sheets
3.3V: Esp32_USB (9 pins), Peripheral (SJ2.1)
GND: Esp32_USB (53 pins), Peripheral (27 pins)
VBATT: Esp32_USB (D2.2 U4.12), Peripheral (6 pins)
VIN: Esp32_USB (5 pins), Peripheral (C7.1 U5.1)
VUSB: Esp32_USB (D1.2 J1.A4-B9 U1.5 U4.10), Peripheral (C14.2 SJ3.1 U8.4)
NetP1_1: Esp32_USB (U3.12 U4.1), Peripheral (P1.1 R16.2 U6.8)
NetP1_2: Esp32_USB (U3.13 U4.2), Peripheral (P1.2 R15.2 U6.7)
NetR7_1: Esp32_USB (U3.41), Peripheral (R7.1 R8.2 U5.3)
NetR9_2: Esp32_USB (U3.27), Peripheral (R9.2 SD1.1)
NetR10_2: Esp32_USB (U3.28), Peripheral (R10.2 SD1.2)
NetR11_2: Esp32_USB (U3.29), Peripheral (R11.2 SD1.3)
NetR12_2: Esp32_USB (U3.34), Peripheral (R12.2 SD1.5)
NetSD1_7: Esp32_USB (U3.35), Peripheral (SD1.7)
NetSD1_8: Esp32_USB (U3.36), Peripheral (SD1.8)
NetSD1_9: Esp32_USB (U3.30), Peripheral (SD1.9)
NetU3_31: Esp32_USB (U3.31), Peripheral (U6.5)
NetU3_44: Esp32_USB (U3.44), Peripheral (U7.4)